# EAGLE design 8296 Diag CP (EAGLE 9.6.2)
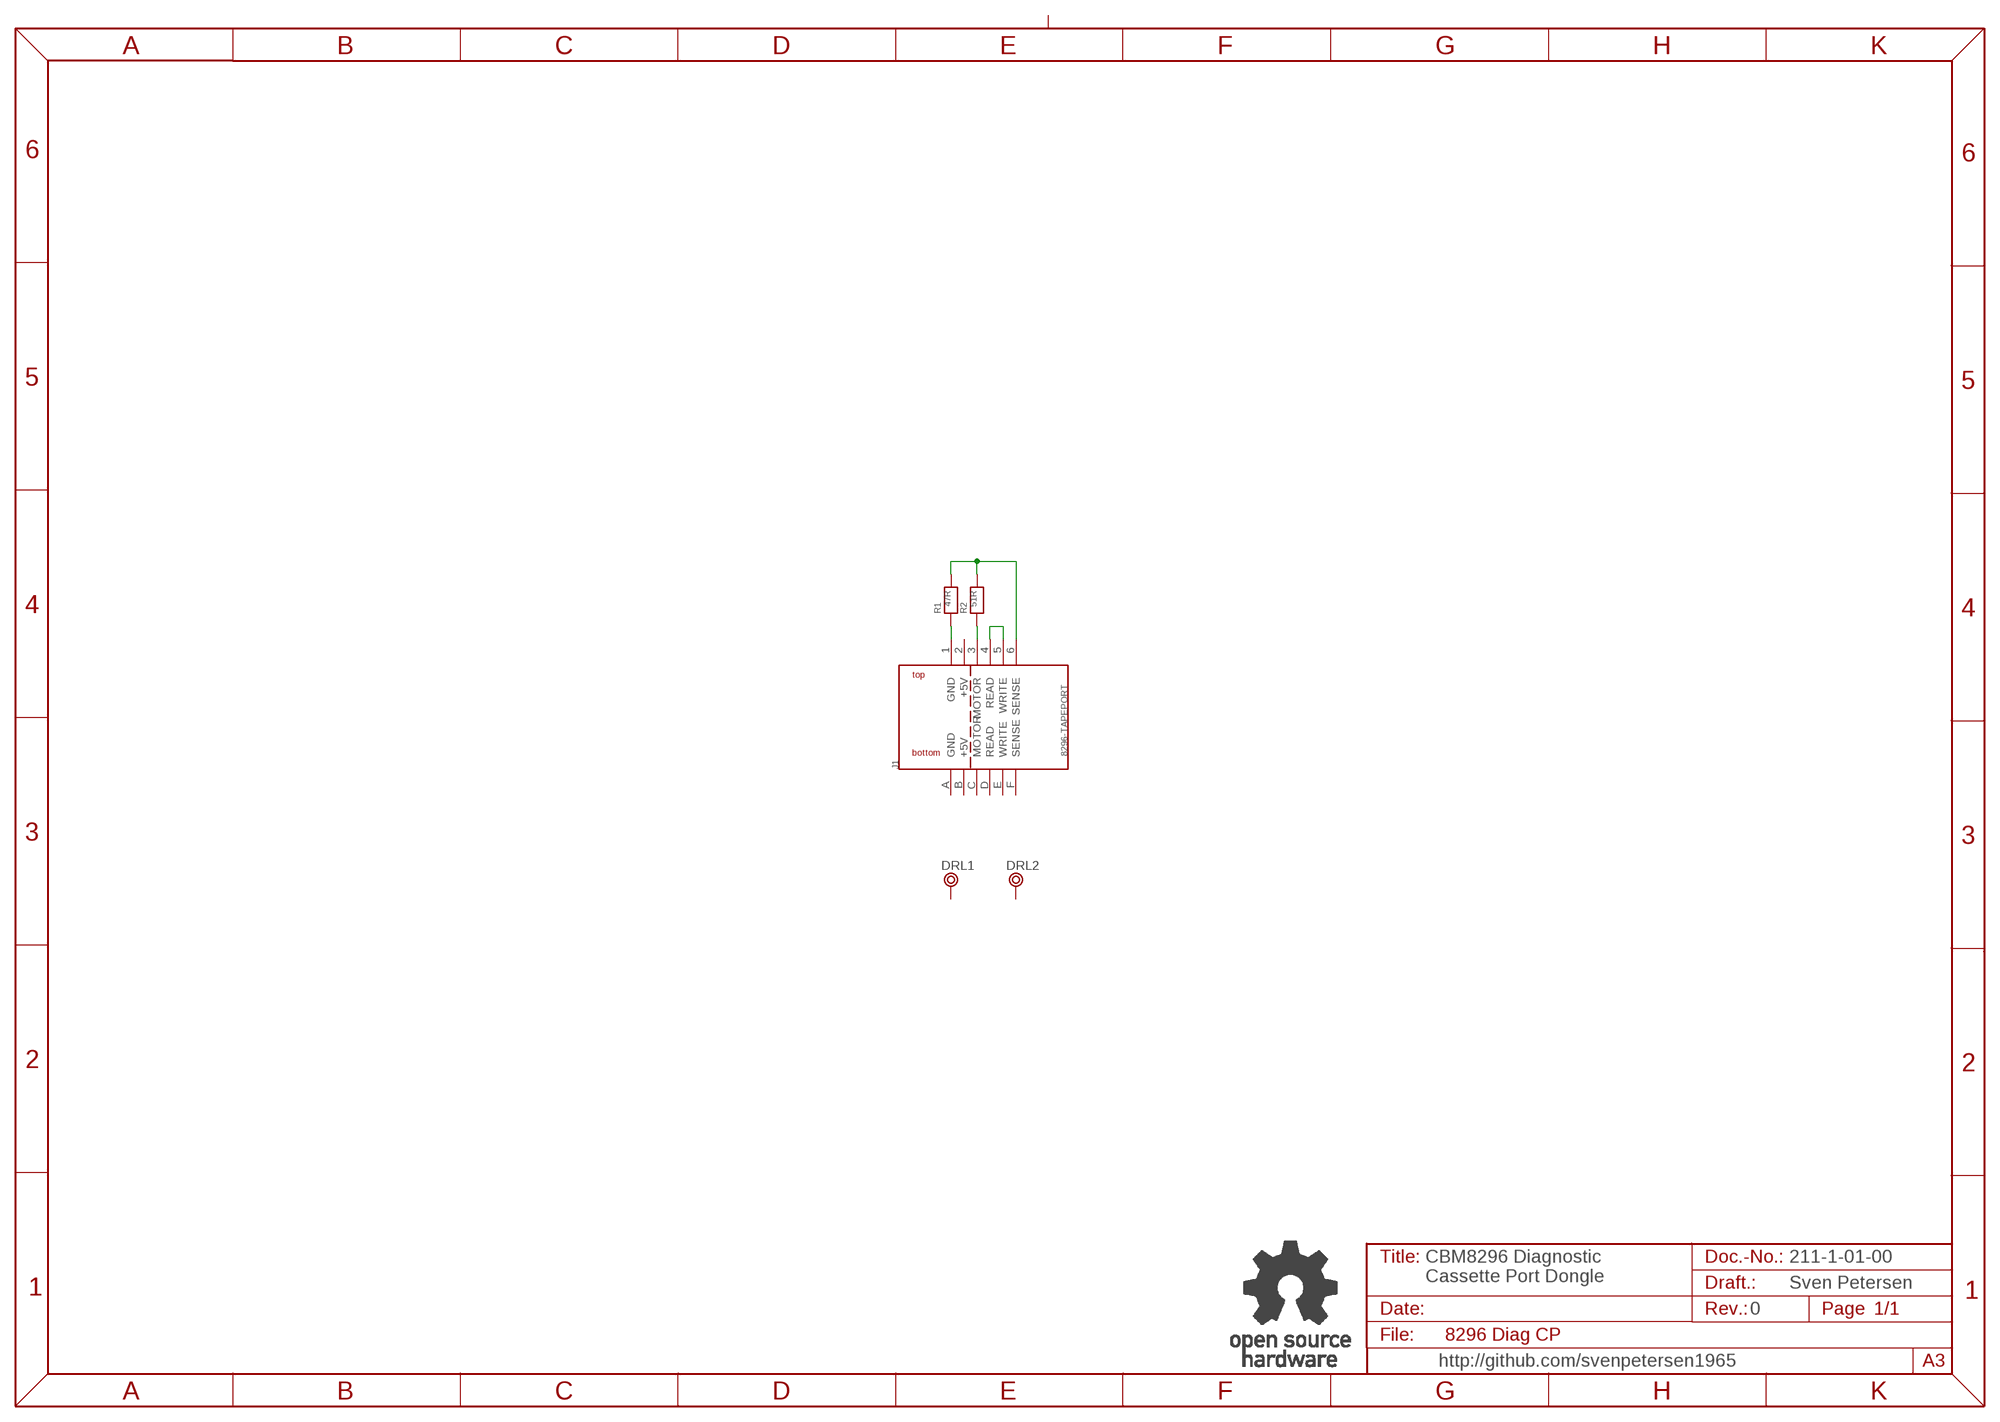
[diagram p0: schematic, sheet 1]

## Parts
DRL1  BOHR3,5  [BOHR3,5]
DRL2  BOHR3,5  [BOHR3,5]
J1  8296-TAPEPORT  C64-TAPEPORT  [TAPEPORT]
R1  47R  RES04  [R-10]
R2  51R  RES04  [R-10]
U$13  OPEN_SOURCE_HW  [OPENHW]

## Nets
N$1: J1.6(SENSE) R1.2 R2.2
N$2: J1.3(MOTOR) R2.1
N$3: J1.1(GND) R1.1
N$4: J1.4(READ) J1.5(WRITE)
Unconnected: DRL1.P$1 DRL2.P$1 J1.C(MOTOR) J1.D(READ) J1.E(WRITE) J1.F(SENSE)

## Notes on the sheet
- 211-1-01-00
- CBM8296 Diagnostic 
  Cassette Port Dongle
- Sven Petersen
- 0
- http://github.com/svenpetersen1965

## Power pins joined to a net without a drawn wire
+5V: J1.2(+5V) J1.B(+5V)
GND: J1.A(GND)

## Library data of the parts
DRL1 DRL2 = Mech_Bohr:BOHR3,5
J1 = Commodore:C64-TAPEPORT
R1 R2 = DISCRETE:RES04
U$13 = Logo:OPEN_SOURCE_HW

## Board
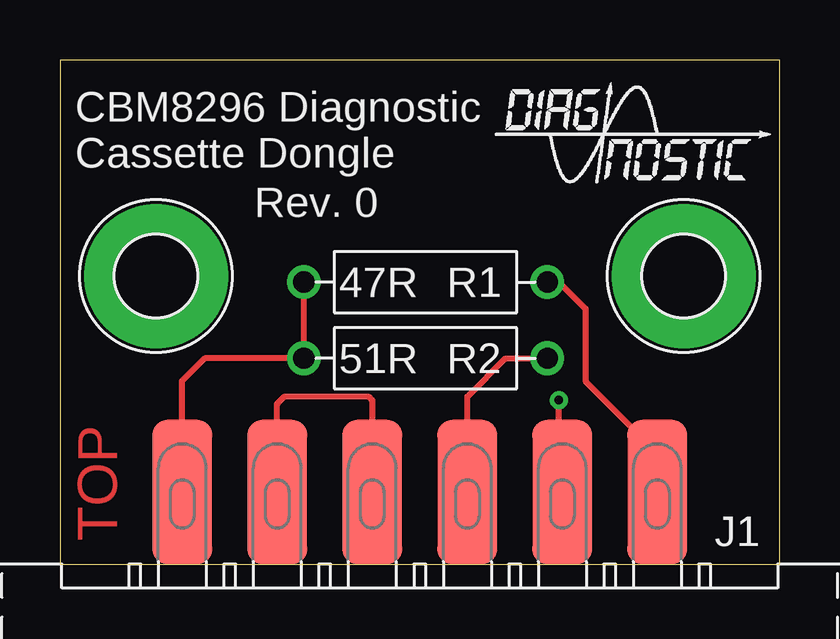
[diagram p1: board, top side]
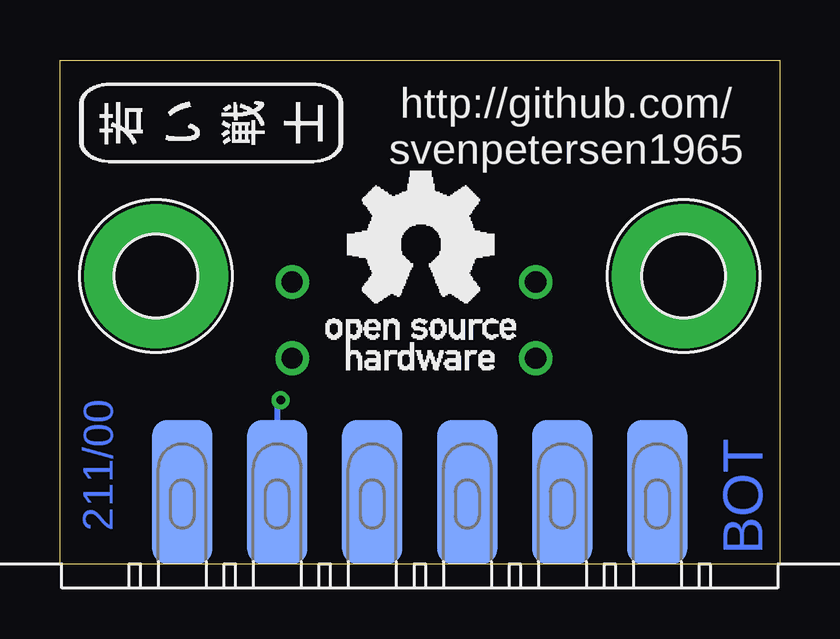
[diagram p2: board, bottom side, seen from below]

Size 30 x 21 mm. Coordinates in mm from the lower left corner, seen from the top.
Outline: 0,0 30,0 30,21 0,21 0,0
Copper layers (1*16): Top 0.035mm / dielectric 1.5mm / Bottom 0.035mm
Design rules "default *": minimum track width 6mil, minimum drill 0.35mm, track to track 6mil, track to pad 6mil, pad to pad 6mil, via to via 6mil, smd to smd 6mil, copper to edge 40mil, drill to drill 6mil, minimum pad ring 10mil, minimum via ring 8mil, stop-mask expansion 4mil, vias tented up to drill 25mil, thermal gap 10mil

### Footprints (pad centres in the part's own frame; a part is rotated, then mirrored left to right if it is on the bottom)
BOHR3,5 = drill 3.5 pad 6: P$1 0,0
TAPEPORT = smd 2.5 x 6: 1 -9.9,-3; 2 -5.94,-3; 3 -1.98,-3; 4 1.98,-3; 5 5.94,-3; 6 9.9,-3 | smd 2.5 x 6 bottom: A -9.9,-3; B -5.94,-3; C -1.98,-3; D 1.98,-3; E 5.94,-3; F 9.9,-3
R-10 = drill 0.889 pad 1.397: 1 -5.08,0; 2 5.08,0

### Placement (x,y rotation side)
DRL1  4,12 0 top
DRL2  26,12 0 top
J1  15,0 180 top
R1  15.24,11.75 180 top
R2  15.24,8.57 180 top
U$2  [DIAG_SMALL]  18.1,15.88 0 top
U$3  [2LAYER]  2.38,0.95 90 top
U$4  [SVEN_TAG]  23.81,18.41 90 bottom
U$5  [PCB-TITLE/]  0,28.1 0 top  (outside the outline)
U$13  18.89,8.1 0 bottom

### Tracks (layer width: path | path; a pad name or v marks a point on that pad's centre or on a via)
+5V  (via drill 0.35)
  Top 0.254: J1.B 20.8,3.14 v20.8,6.83
  Bottom 0.254: v20.8,6.83 20.94,6.68 J1.B
N$1
  Top 0.254: R1.2 R2.2 6.03,8.57 5.08,7.62 5.08,3.02 J1.6
N$2
  Top 0.254: J1.3 16.98,6.98 18.57,8.57 R2.1
N$3
  Top 0.254: R1.1 20.8,11.75 21.91,10.64 21.91,7.62 24.92,4.6 24.92,3.02 J1.1
N$4
  Top 0.254: J1.5 9.06,6.66 9.05,6.67 9.37,6.99 12.86,6.99 13.02,6.82 J1.4

### Text on the board
Bottom: 211/00
tNames: CBM8296 Diagnostic / Cassette Dongle | Rev. 0
bNames: http://github.com/ / svenpetersen1965
Document: 211-2-01-00 | Sven Petersen / 2023 | 35µm | 2 | 0